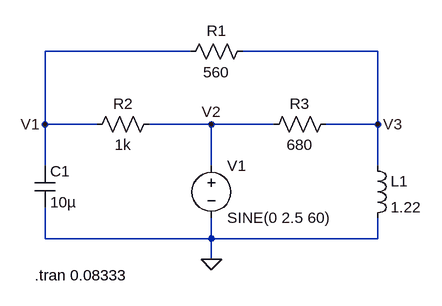
[diagram p0: schematic nodos.asc]
nodos.asc, the LTspice schematic file:
Version 4
SHEET 1 880 680
WIRE 128 32 -96 32
WIRE 416 32 208 32
WIRE -96 144 -96 32
WIRE -16 144 -96 144
WIRE 160 144 64 144
WIRE 256 144 160 144
WIRE 416 144 416 32
WIRE 416 144 336 144
WIRE -96 208 -96 144
WIRE 160 208 160 144
WIRE 416 208 416 144
WIRE -96 320 -96 272
WIRE 160 320 160 288
WIRE 160 320 -96 320
WIRE 416 320 416 288
WIRE 416 320 160 320
WIRE 160 352 160 320
FLAG 160 352 0
FLAG -96 144 V1
FLAG 160 144 V2
FLAG 416 144 V3
SYMBOL cap -112 208 R0
SYMATTR InstName C1
SYMATTR Value 10µ
SYMBOL res 80 128 R90
WINDOW 0 0 56 VBottom 2
WINDOW 3 32 56 VTop 2
SYMATTR InstName R2
SYMATTR Value 1k
SYMBOL res 352 128 R90
WINDOW 0 0 56 VBottom 2
WINDOW 3 32 56 VTop 2
SYMATTR InstName R3
SYMATTR Value 680
SYMBOL voltage 160 192 R0
WINDOW 123 0 0 Left 2
WINDOW 39 0 0 Left 2
SYMATTR InstName V1
SYMATTR Value SINE(0 2.5 60)
SYMBOL ind 400 192 R0
SYMATTR InstName L1
SYMATTR Value 1.22
SYMBOL res 224 16 R90
WINDOW 0 0 56 VBottom 2
WINDOW 3 32 56 VTop 2
SYMATTR InstName R1
SYMATTR Value 560
TEXT -112 376 Left 2 !.tran 0.08333

The netlist it stands for:
* nodos.asc
C1 V1 0 10µ
R2 V2 V1 1k
R3 V3 V2 680
V1 V2 0 SINE(0 2.5 60)
L1 V3 0 1.22
R1 V3 V1 560
.tran 0.08333
.backanno
.end